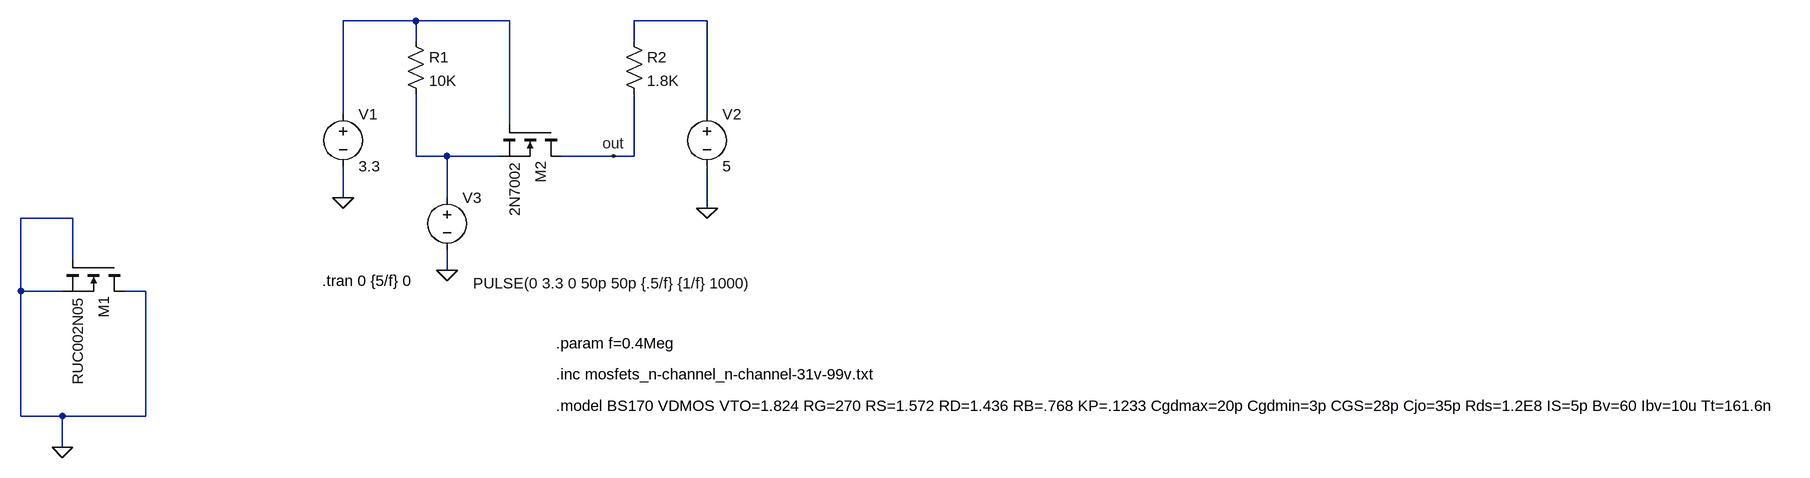
[diagram p0: schematic simulation.asc]
simulation.asc, the LTspice schematic file:
Version 4
SHEET 1 3388 784
WIRE 80 32 -32 32
WIRE 224 32 80 32
WIRE 528 32 416 32
WIRE 80 64 80 32
WIRE 416 64 416 32
WIRE -32 176 -32 32
WIRE 528 176 528 32
WIRE 224 192 224 32
WIRE 80 240 80 144
WIRE 128 240 80 240
WIRE 208 240 128 240
WIRE 384 240 304 240
WIRE 416 240 416 144
WIRE 416 240 384 240
WIRE -32 304 -32 256
WIRE 128 304 128 240
WIRE 528 320 528 256
WIRE -448 336 -528 336
WIRE -448 400 -448 336
WIRE 128 416 128 384
WIRE -528 448 -528 336
WIRE -464 448 -528 448
WIRE -336 448 -368 448
WIRE -528 640 -528 448
WIRE -464 640 -528 640
WIRE -336 640 -336 448
WIRE -336 640 -464 640
WIRE -464 688 -464 640
FLAG -32 304 0
FLAG 528 320 0
FLAG 128 416 0
FLAG 384 240 out
FLAG -464 688 0
SYMBOL res 64 48 R0
SYMATTR InstName R1
SYMATTR Value 10K
SYMBOL res 400 48 R0
SYMATTR InstName R2
SYMATTR Value 1.8K
SYMBOL voltage -32 160 R0
WINDOW 123 0 0 Left 0
WINDOW 39 0 0 Left 0
SYMATTR InstName V1
SYMATTR Value 3.3
SYMBOL voltage 528 160 R0
WINDOW 123 0 0 Left 0
WINDOW 39 0 0 Left 0
SYMATTR InstName V2
SYMATTR Value 5
SYMBOL nmos -368 400 R90
SYMATTR InstName M1
SYMATTR Value RUC002N05
SYMBOL voltage 128 288 R0
WINDOW 123 0 0 Left 0
WINDOW 39 0 0 Left 0
WINDOW 3 40 148 Left 2
SYMATTR InstName V3
SYMATTR Value PULSE(0 3.3 0 50p 50p {.5/f} {1/f} 1000)
SYMBOL nmos 304 192 R90
SYMATTR InstName M2
SYMATTR Value 2N7002
TEXT -64 432 Left 2 !.tran 0 {5/f} 0
TEXT 296 576 Left 2 !.inc mosfets_n-channel_n-channel-31v-99v.txt
TEXT 296 528 Left 2 !.param f=0.4Meg
TEXT 296 624 Left 2 !.model BS170 VDMOS VTO=1.824 RG=270 RS=1.572 RD=1.436 RB=.768 KP=.1233 Cgdmax=20p Cgdmin=3p CGS=28p Cjo=35p Rds=1.2E8 IS=5p Bv=60 Ibv=10u Tt=161.6n

The netlist it stands for:
* simulation.asc
R1 N001 N003 10K
R2 N002 out 1.8K
V1 N001 0 3.3
V2 N002 0 5
M1 0 0 0 0 RUC002N05
V3 N003 0 PULSE(0 3.3 0 50p 50p {.5/f} {1/f} 1000)
M2 out N001 N003 N003 2N7002
.model NMOS NMOS
.model PMOS PMOS
.lib standard.mos
.tran 0 {5/f} 0
.inc mosfets_n-channel_n-channel-31v-99v.txt
.param f=0.4Meg
.model BS170 VDMOS VTO=1.824 RG=270 RS=1.572 RD=1.436 RB=.768 KP=.1233 Cgdmax=20p Cgdmin=3p CGS=28p Cjo=35p Rds=1.2E8 IS=5p Bv=60 Ibv=10u Tt=161.6n
.backanno
.end